# Altium schematic sheet NNLightSwitcher_main.SchDoc
size A4
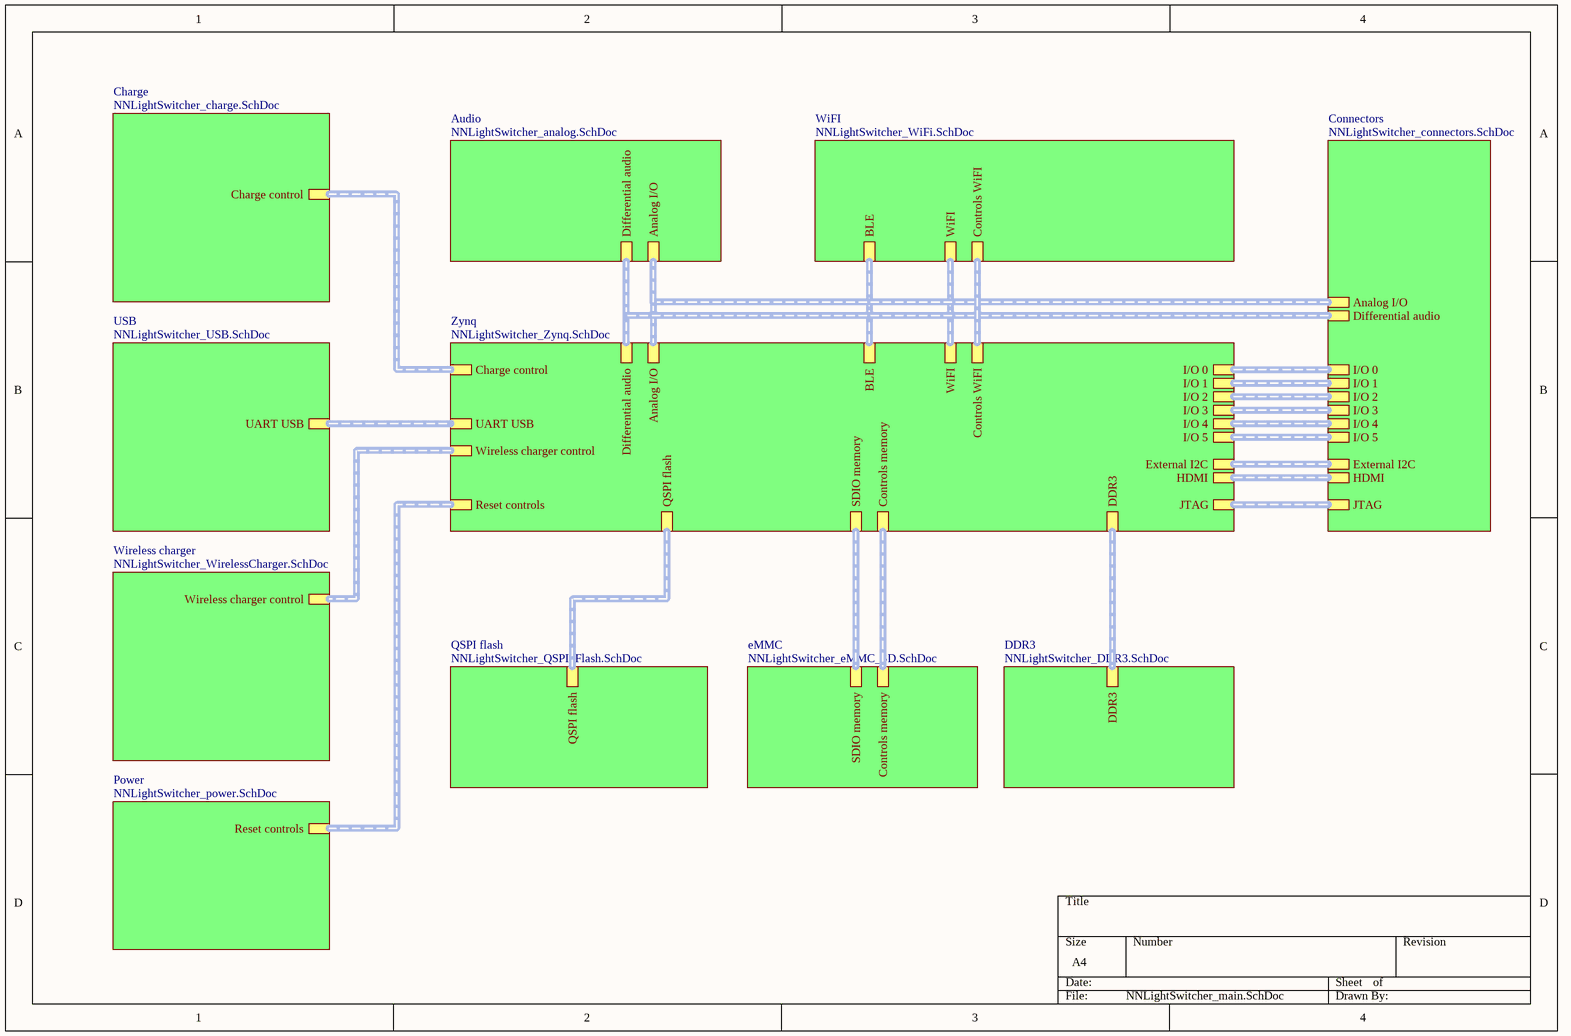
[diagram p0: NNLightSwitcher_main.SchDoc]

## Sub-sheets
Audio = NNLightSwitcher_analog.SchDoc: Analog I/O (harness GPIO), Differential audio (harness Differential Audio)
Charge = NNLightSwitcher_charge.SchDoc: Charge control (harness I2C)
Connectors = NNLightSwitcher_connectors.SchDoc: I/O 0 (harness GPIO), HDMI (harness HDMI), JTAG (harness JTAG), I/O 1 (harness GPIO), I/O 2 (harness GPIO), I/O 3 (harness GPIO), I/O 4 (harness GPIO), I/O 5 (harness GPIO), External I2C (harness I2C), Analog I/O (harness GPIO), Differential audio (harness Differential Audio)
DDR3 = NNLightSwitcher_DDR3.SchDoc: DDR3 (harness DDR3)
eMMC = NNLightSwitcher_eMMC_SD.SchDoc: SDIO memory (harness SDIO), Controls memory (harness Controls flash)
Power = NNLightSwitcher_power.SchDoc: Reset controls (harness Controls reset)
QSPI flash = NNLightSwitcher_QSPI_Flash.SchDoc: QSPI flash (harness QuadSPI)
USB = NNLightSwitcher_USB.SchDoc: UART USB (harness UART)
WiFI = NNLightSwitcher_WiFi.SchDoc: BLE (harness UART), WiFI (harness SDIO), Controls WiFI (harness Controls WiFI)
Wireless charger = NNLightSwitcher_WirelessCharger.SchDoc: Wireless charger control (harness GPIO)
Zynq = NNLightSwitcher_Zynq.SchDoc: Charge control (harness I2C), UART USB (harness UART), BLE (harness UART), WiFI (harness SDIO), DDR3 (harness DDR3), SDIO memory (harness SDIO), QSPI flash (harness QuadSPI), Reset controls (harness Controls reset), I/O 0 (harness GPIO), JTAG (harness JTAG), I/O 2 (harness GPIO), I/O 3 (harness GPIO), I/O 4 (harness GPIO), I/O 1 (harness GPIO), HDMI (harness HDMI), I/O 5 (harness GPIO), Wireless charger control (harness GPIO), External I2C (harness I2C), Analog I/O (harness GPIO), Controls memory (harness Controls flash), Differential audio (harness Differential Audio), Controls WiFI (harness Controls WiFI)

## Buses and harness runs
harness sheet Audio/Analog I/O = sheet Connectors/Analog I/O = sheet Zynq/Analog I/O
harness sheet Audio/Differential audio = sheet Connectors/Differential audio = sheet Zynq/Differential audio
harness sheet Charge/Charge control = sheet Zynq/Charge control
harness sheet Connectors/External I2C = sheet Zynq/External I2C
harness sheet Connectors/HDMI = sheet Zynq/HDMI
harness sheet Connectors/I/O 0 = sheet Zynq/I/O 0
harness sheet Connectors/I/O 1 = sheet Zynq/I/O 1
harness sheet Connectors/I/O 2 = sheet Zynq/I/O 2
harness sheet Connectors/I/O 3 = sheet Zynq/I/O 3
harness sheet Connectors/I/O 4 = sheet Zynq/I/O 4
harness sheet Connectors/I/O 5 = sheet Zynq/I/O 5
harness sheet Connectors/JTAG = sheet Zynq/JTAG
harness sheet DDR3/DDR3 = sheet Zynq/DDR3
harness sheet eMMC/Controls memory = sheet Zynq/Controls memory
harness sheet eMMC/SDIO memory = sheet Zynq/SDIO memory
harness sheet Power/Reset controls = sheet Zynq/Reset controls
harness sheet QSPI flash/QSPI flash = sheet Zynq/QSPI flash
harness sheet USB/UART USB = sheet Zynq/UART USB
harness sheet WiFI/BLE = sheet Zynq/BLE
harness sheet WiFI/Controls WiFI = sheet Zynq/Controls WiFI
harness sheet WiFI/WiFI = sheet Zynq/WiFI
harness sheet Wireless charger/Wireless charger control = sheet Zynq/Wireless charger control